# EAGLE schematic 14226 (EAGLE 7.6.0)
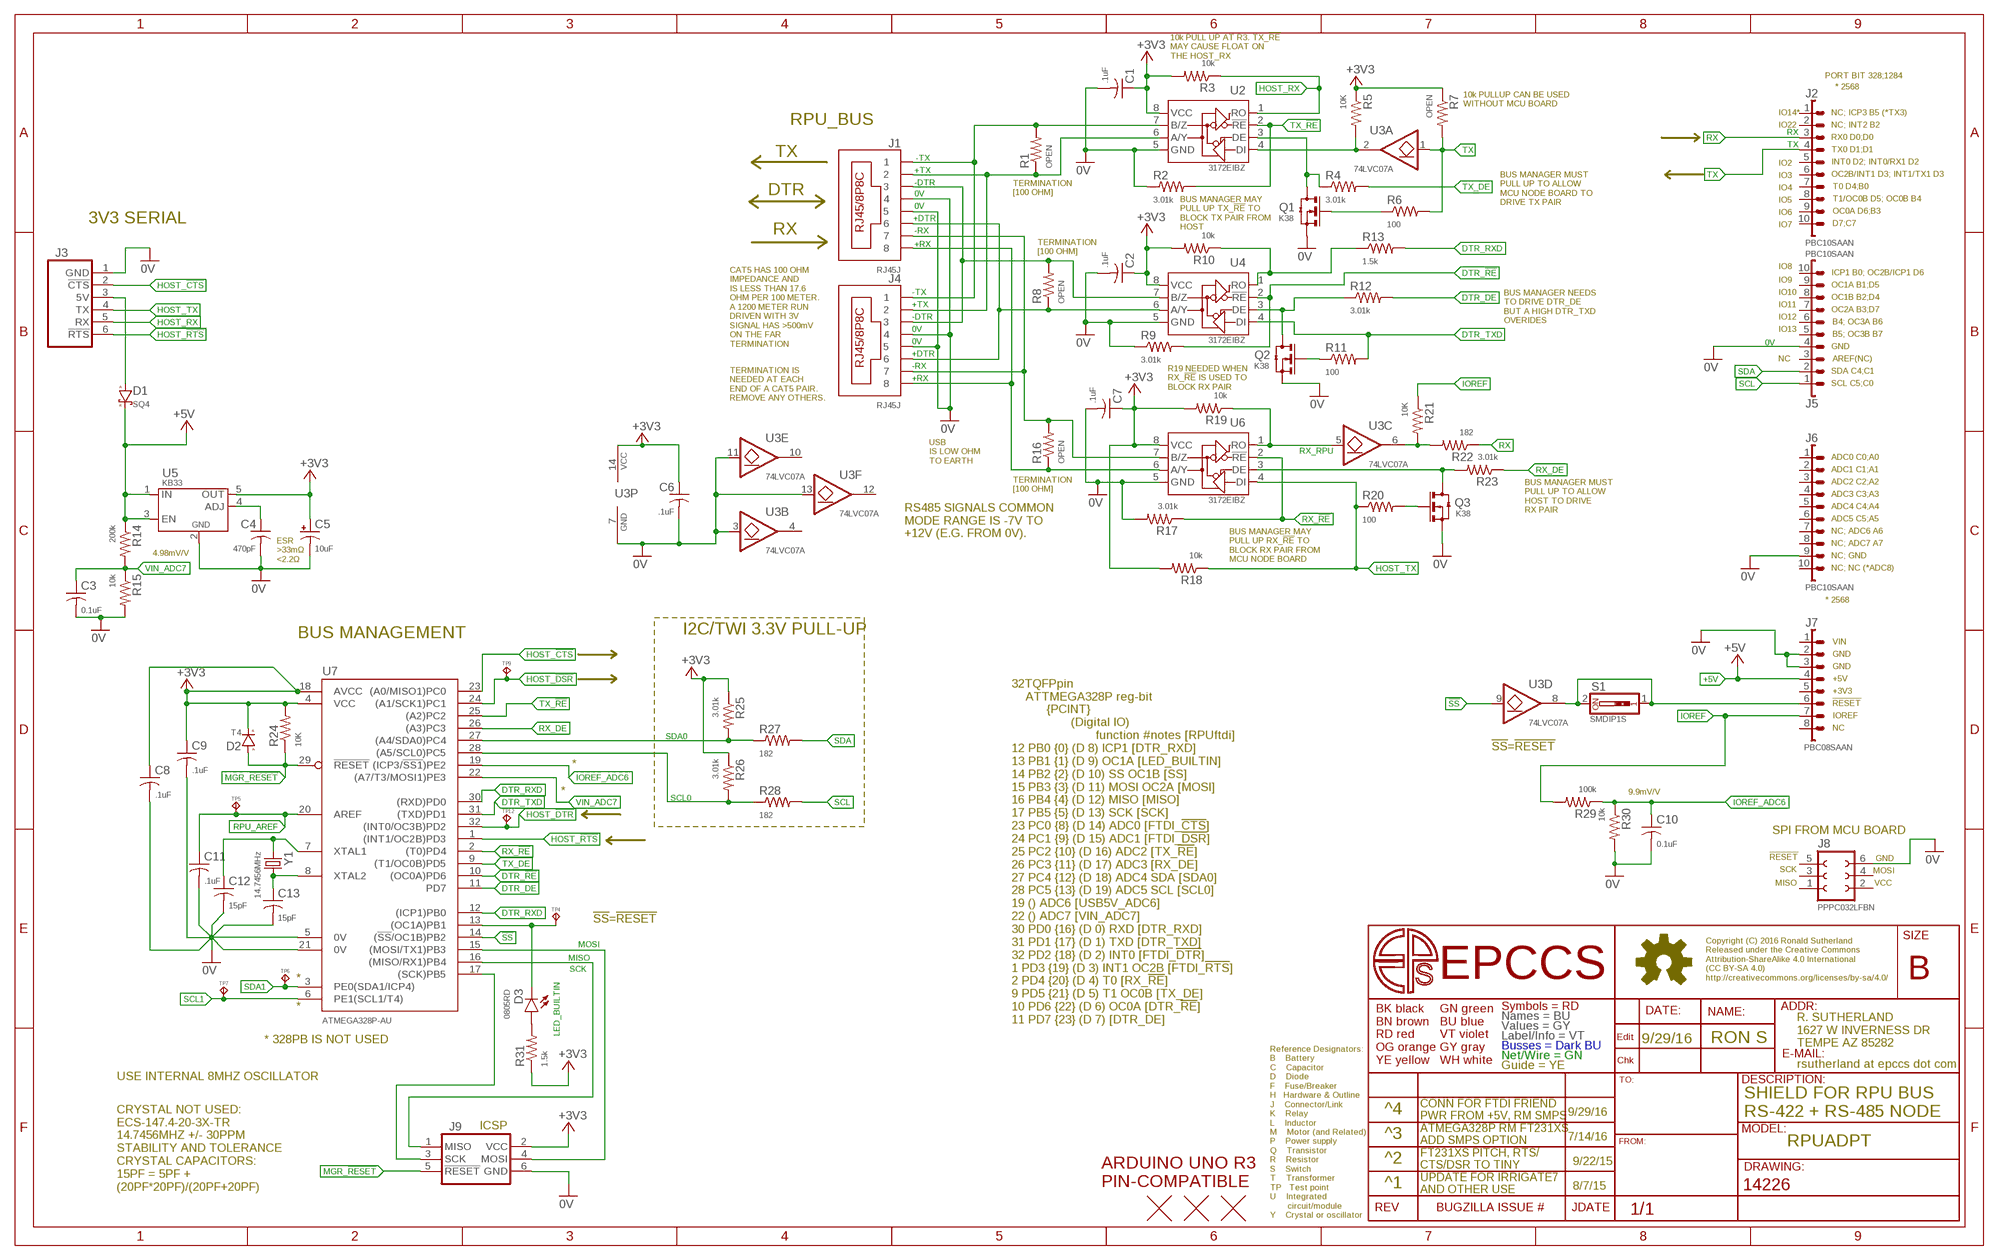
[diagram p0: schematic, sheet 1]

## Parts
C1  .1uF  CC0603A  [C0603(1608)]
C2  .1uF  CC0603A  [C0603(1608)]
C3  0.1uF  CC0603A  [C0603(1608)]
C4  470pF  CC0603A  [C0603(1608)]
C5  10uF  CT1206  [3216]
C6  .1uF  CC0603A  [C0603(1608)]
C7  .1uF  CC0603A  [C0603(1608)]
C8  .1uF  CC0603A  [C0603(1608)]
C9  .1uF  CC0603A  [C0603(1608)]
C10  0.1uF  CC0603A  [C0603(1608)]
C11  .1uF  CC0603A  [C0603(1608)]
C12  15pF  CC0603A  [C0603(1608)]
C13  15pF  CC0603A  [C0603(1608)]
D1  SQ4  DSMA  [SMA]
D2  T4  DSOD123  [SOD123]
D3  0805RD  LEDC0805(2012)  [C0805(2012)]
J1  RJ45J  RJ45-8HZT  [RJ45-8HZT]
J2  PBC10SAAN  1X10"  [1X10]
J3  FTDI-FRIEND  [FTDI-FRIEND]
J4  RJ45J  RJ45-8HZT  [RJ45-8HZT]
J5  PBC10SAAN  1X10"  [1X10]
J6  PBC10SAAN  1X10"  [1X10]
J7  PBC08SAAN  1X8"  [1X8]
J8  PPPC032LFBN  F2X3  [F2X3]
J9  ISP-SPIPTH  [ISP]
Q1  K38  N-CHSOT23  [SOT23]
Q2  K38  N-CHSOT23  [SOT23]
Q3  K38  N-CHSOT23  [SOT23]
R1  OPEN  R0805  [C0805(2012)]
R2  3.01k  R0805  [C0805(2012)]
R3  10k  R0805  [C0805(2012)]
R4  3.01k  R0805  [C0805(2012)]
R5  10K  R0805  [C0805(2012)]
R6  100  R0805  [C0805(2012)]
R7  OPEN  R0805  [C0805(2012)]
R8  OPEN  R0805  [C0805(2012)]
R9  3.01k  R0805  [C0805(2012)]
R10  10k  R0805  [C0805(2012)]
R11  100  R0805  [C0805(2012)]
R12  3.01k  R0805  [C0805(2012)]
R13  1.5k  R0805  [C0805(2012)]
R14  200k  R0805  [C0805(2012)]
R15  10k  R0805  [C0805(2012)]
R16  OPEN  R0805  [C0805(2012)]
R17  3.01k  R0805  [C0805(2012)]
R18  10k  R0805  [C0805(2012)]
R19  10k  R0805  [C0805(2012)]
R20  100  R0805  [C0805(2012)]
R21  10K  R0805  [C0805(2012)]
R22  182  R0805  [C0805(2012)]
R23  3.01k  R0805  [C0805(2012)]
R24  10K  R0805  [C0805(2012)]
R25  3.01k  R0805  [C0805(2012)]
R26  3.01k  R0805  [C0805(2012)]
R27  182  R0805  [C0805(2012)]
R28  182  R0805  [C0805(2012)]
R29  100k  R0805  [C0805(2012)]
R30  10k  R0805  [C0805(2012)]
R31  1.5k  R0805  [C0805(2012)]
S1  SMDIP1S  SW_DIP-1SMD  [SMD-DIPSWITCH-1]
TP4  TPPAD1-08  [P1-08]
TP5  TPPAD1-08  [P1-08]
TP6  TPPAD1-08  [P1-08]
TP7  TPPAD1-08  [P1-08]
TP9  TPPAD1-08  [P1-08]
TP12  TPPAD1-08  [P1-08]
U2  3172EIBZ  ISL3172EIBZ  [SOIC8]
U3  74LVC07A  7407D  [14SOIC]
U4  3172EIBZ  ISL3172EIBZ  [SOIC8]
U5  KB33  MIC5205  [SOT23-5,SOT25]
U6  3172EIBZ  ISL3172EIBZ  [SOIC8]
U7  ATMEGA328P-AU  ATMEGA328PB-AU  [TQFP32-08]
U$1  ARDUINO-UNO  [ARDUINO_UNO]
U$2  FIDUCIAL1.27  [FIDUCIAL-1.27]
U$3  FIDUCIAL1.27  [FIDUCIAL-1.27]
U$4  FIDUCIAL1.27  [FIDUCIAL-1.27]
Y1  14.7456MHz  CSM-3X  [CSM-3X]

## Nets
0V: C1.2 C2.2 C3.2 C4.2 C5.- C6.2 C7.2 C8.2 C9.2 C10.2 C11.2 C12.2 C13.2 J1.4 J1.5 J3.1(GND) J4.4 J4.5 J5.4 J6.9 J7.2 J7.3 J8.6 J9.6(GND) Q1.2(S)(S) Q2.2(S)(S) Q3.2(S)(S) R2.1 R9.1 R15.2 R17.2 R30.2 U2.5(GND) U3.3(B:I) U3.7(P:GND) U3.11(E:I) U3.13(F:I) U4.5(GND) U5.2(GND) U6.5(GND) U7.5(0V) U7.21(0V)
!SS!: U3.9(D:I) U7.14((!SS!/OC1B)PB2)
+3V3: C1.1 C2.1 C5.+ C6.1 C7.1 C8.1 C9.1 D2.C(K) J9.2(VCC) R3.2 R5.1 R7.1 R10.2 R18.2 R19.2 R24.2 R25.1 R26.1 R31.1 U2.8(VCC) U3.14(P:VCC) U4.8(VCC) U5.5(OUT) U6.8(VCC) U7.4(VCC) U7.18(AVCC)
+5V: D1.K J7.4 R14.1 U5.1(IN) U5.3(EN)
+DTR: J1.6 J4.6 R8.1 U4.6(A/Y)
+RX: J1.8 J4.8 R16.1 U6.6(A/Y)
+TX: J1.2 J4.2 R1.1 U2.6(A/Y)
-DTR: J1.3 J4.3 R8.2 U4.7(B/Z)
-RX: J1.7 J4.7 R16.2 U6.7(B/Z)
-TX: J1.1 J4.1 R1.2 U2.7(B/Z)
DTR_!RE: R9.2 U4.2(!RE) U7.10((OC0A)PD6)
DTR_DE: R12.2 U7.11(PD7)
DTR_RXD: R13.2 U7.12((ICP1)PB0) U7.30((RXD)PD0)
DTR_TXD: R11.2 U4.4(DI) U7.31((TXD)PD1)
HOST_!CTS: J3.2(!CTS) U7.23((A0/MISO1)PC0)
HOST_!DSR: TP9.TP U7.24((A1/SCK1)PC1)
HOST_!DTR: TP12.TP U7.32((INT0/OC3B)PD2)
HOST_!RTS: J3.6(!RTS) U7.1((INT1/OC2B)PD3)
HOST_RX: J3.5(RX) R3.1 U2.1(RO)
HOST_TX: J3.4(TX) R18.1 R20.1 U6.4(DI)
IOREF: J7.7 R21.1 R29.2
IOREF_ADC6: C10.1 R29.1 R30.1 U7.19((ICP3/!SS1!)PE2)
LED_BUILTIN: D3.K TP4.TP U7.13((OC1A)PB1)
MGR_!RESET: D2.A J9.5(!RESET) R24.1 U7.29(!RESET)
MISO: J9.1(MISO) U7.16((MISO/RX1)PB4)
MOSI: J9.4(MOSI) U7.15((MOSI/TX1)PB3)
N$1: D1.A J3.3(5V)
N$3: J7.6 S1.1 S1.2 U3.8(D:O)
N$10: R21.2 R22.2 U3.6(C:O)
N$11: Q3.3(D)(D) R23.2 U6.3(DE)
N$15: Q1.1(G)(G) R6.1
N$18: Q1.3(D)(D) R4.1 U2.3(DE)
N$19: R10.1 R13.1 U4.1(RO)
N$20: Q2.3(D)(D) R12.1 U4.3(DE)
N$22: Q2.1(G)(G) R11.1
N$24: C4.1 U5.4(ADJ)
N$25: Q3.1(G)(G) R20.2
N$29: D3.A R31.2
RPU_AREF: C11.1 TP5.TP U7.20(AREF)
RX: J2.3 R22.1
RX_!RE: R17.1 U6.2(!RE) U7.2((T0)PD4)
RX_DE: R23.1 U7.26((A3)PC3)
RX_RPU: R19.1 U3.5(C:I) U6.1(RO)
SCK: J9.3(SCK) U7.17((SCK)PB5)
SCL: J5.1 R28.2
SCL0: R26.2 R28.1 U7.28((A5/SCL0)PC5)
SCL1: TP7.TP U7.6(PE1(SCL1/T4))
SDA: J5.2 R27.2
SDA0: R25.2 R27.1 U7.27((A4/SDA0)PC4)
SDA1: TP6.TP U7.3(PE0(SDA1/ICP4))
TX: J2.4 R6.2 R7.2 U3.1(A:I)
TX_!RE: R2.2 U2.2(!RE) U7.25((A2)PC2)
TX_DE: R4.2 U7.9((T1/OC0B)PD5)
TX_RPU: R5.2 U2.4(DI) U3.2(A:O)
VIN_ADC7: C3.1 R14.2 R15.1 U7.22((A7/T3/MOSI1)PE3)
XTAL1: C12.1 U7.7(XTAL1) Y1.1
XTAL2: C13.1 U7.8(XTAL2) Y1.2
Unconnected: J2.1 J2.2 J2.5 J2.6 J2.7 J2.8 J2.9 J2.10 J5.3 J5.5 J5.6 J5.7 J5.8 J5.9 J5.10 J6.1 J6.2 J6.3 J6.4 J6.5 J6.6 J6.7 J6.8 J6.10 J7.1 J7.5 J7.8 J8.1 J8.2 J8.3 J8.4 J8.5 U3.4(B:O) U3.10(E:O) U3.12(F:O)

## Notes on the sheet
- 10k PULL UP AT R3. TX_!RE!
  MAY CAUSE FLOAT ON
  THE HOST_RX
- PORT BIT 328;1284
- * 2568
- 10k PULLUP CAN BE USED 
  WITHOUT MCU BOARD
- IO14* | NC; ICP3 B5 (*TX3)
- RPU_BUS | IO22 | NC; INT2 B2
- RX0 D0;D0
- TX0 D1;D1
- TX
- IO2 | INT0 D2; INT0/RX1 D2
- IO3 | OC2B/INT1 D3; INT1/TX1 D3
- IO4 | T0 D4;B0
- DTR
- TERMINATION
  [100 OHM]
- IO5 | T1/OC0B D5; OC0B B4
- BUS MANAGER MUST
  PULL UP TO ALLOW 
  MCU NODE BOARD TO 
  DRIVE TX PAIR
- IO6 | OC0A D6;B3
- 3V3 SERIAL | D7;C7
- IO7
- BUS MANAGER MAY
  PULL UP TX_!RE! TO
  BLOCK TX PAIR FROM
  HOST
- RX
- TERMINATION
  [100 OHM]
- IO8
- ICP1 B0; OC2B/ICP1 D6
- IO9
- OC1A B1;D5
- IO10
- OC1B B2;D4
- IO11
- OC2A B3;D7
- IO12
- BUS MANAGER NEEDS
  TO DRIVE DTR_DE
  BUT A HIGH DTR_TXD
  OVERIDES
- B4; OC3A B6
- IO13
- B5; OC3B B7
- CAT5 HAS 100 OHM 
  IMPEDANCE AND 
  IS LESS THAN 17.6 
  OHM PER 100 METER. 
  A 1200 METER RUN
  DRIVEN WITH 3V 
  SIGNAL HAS >500mV
  ON THE FAR
  TERMINATION
- GND
- NC | AREF(NC)
- SDA C4;C1
- SCL C5;C0
- R19 NEEDED WHEN
  RX_!RE! IS USED TO
  BLOCK RX PAIR
- TERMINATION IS 
  NEEDED AT EACH
  END OF A CAT5 PAIR.
  REMOVE ANY OTHERS.
- ADC0 C0;A0
- USB
  IS LOW OHM
  TO EARTH
- ADC1 C1;A1
- ADC2 C2;A2
- TERMINATION
  [100 OHM]
- ADC3 C3;A3
- ADC4 C4;A4
- BUS MANAGER MUST
  PULL UP TO ALLOW 
  HOST TO DRIVE
  RX PAIR
- ADC5 C5;A5
- NC; ADC6 A6
- RS485 SIGNALS COMMON 
  MODE RANGE IS -7V TO 
  +12V (E.G. FROM 0V).
- NC; ADC7 A7
- 4.98mV/V
- NC; GND
- ESR
  >33mΩ
  <2.2Ω
- BUS MANAGER MAY
  PULL UP RX_!RE! TO 
  BLOCK RX PAIR FROM 
  MCU NODE BOARD
- NC; NC (*ADC8)
- * 2568
- BUS MANAGEMENT | I2C/TWI 3.3V PULL-UP
- VIN
- GND
- GND
- +5V
- +3V3
- !RESET
- IOREF
- NC
- !SS!=!RESET!
- *
- * | 9.9mV/V
- SPI FROM MCU BOARD
- !RESET
- GND
- SCK
- MOSI
- MISO
- VCC
- !SS!=!RESET!
- *
- *
- 32TQFPpin
      ATTMEGA328P reg-bit
            {PCINT}
                   (Digital IO)
                          function #notes [RPUftdi]
  12 PB0 {0} (D 8) ICP1 [DTR_RXD]
  13 PB1 {1} (D 9) OC1A [LED_BUILTIN]
  14 PB2 {2} (D 10) SS OC1B [SS]
  15 PB3 {3} (D 11) MOSI OC2A [MOSI]
  16 PB4 {4} (D 12) MISO [MISO]
  17 PB5 {5} (D 13) SCK [SCK]
  23 PC0 {8} (D 14) ADC0 [FTDI_!CTS!]
  24 PC1 {9} (D 15) ADC1 [FTDI_!DSR!]
  25 PC2 {10} (D 16) ADC2 [TX_!RE!]
  26 PC3 {11} (D 17) ADC3 [RX_DE]
  27 PC4 {12} (D 18) ADC4 SDA [SDA0]
  28 PC5 {13} (D 19) ADC5 SCL [SCL0]
  19 () ADC6 [USB5V_ADC6]
  22 () ADC7 [VIN_ADC7]
  30 PD0 {16} (D 0) RXD [DTR_RXD]
  31 PD1 {17} (D 1) TXD [DTR_TXD]
  32 PD2 {18} (D 2) INT0 [FTDI_!DTR!]
  1 PD3 {19} (D 3) INT1 OC2B [FTDI_!RTS!]
  2 PD4 {20} (D 4) T0 [RX_!RE!]
  9 PD5 {21} (D 5) T1 OC0B [TX_DE]
  10 PD6 {22} (D 6) OC0A [DTR_!RE!]
  11 PD7 {23} (D 7) [DTR_DE]
- * 328PB IS NOT USED | 9/29/16 | RON S
- USE INTERNAL 8MHZ OSCILLATOR
- ^4 | 9/29/16
- SHIELD FOR RPU BUS
  RS-422 + RS-485 NODE
- CONN FOR FTDI FRIEND
  PWR FROM +5V, RM SMPS
- ICSP
- ^3 | 7/14/16
- ATMEGA328P RM FT231XS
  ADD SMPS OPTION
- RPUADPT
- ^2 | 9/22/15
- FT231XS PITCH, RTS/
  CTS/DSR TO TINY
- ^1 | 8/7/15
- CRYSTAL NOT USED:
  ECS-147.4-20-3X-TR
  14.7456MHZ +/- 30PPM
  STABILITY AND TOLERANCE
  CRYSTAL CAPACITORS:
  15PF = 5PF +
  (20PF*20PF)/(20PF+20PF)
- UPDATE FOR IRRIGATE7
  AND OTHER USE

## Library data of the parts
C1-C4 C6-C13 = C-C:C: CAPACITOR Symbol
C5 = C-T:CT: Tantalum Electrolytic Capacitor
D1 = D-SBR:D: DIODE
D2 = D-GP:D: DIODE
D3 = D-LED:LED: LED 120120WH [CREE,XHGAWT-00-0000-00000HXE1] LED WHITE 6500K 150LUM-W120120
J1 J4 = J-RJ45:RJ45-8: RJ45 Jack RJ45J [ASSMANN,A-2014-2-4-R] JACK MODULAR VERT PCB 8P8C UNSHIELD Horz version form sparkfun sku PRT-00643, and breakout board sku is BOB-00716.
J2 J5 J6 = J-HDR2.54mm:1X10: 10 POS HEADER PBC10S [SULLINS,PBC10SAAN]HEADER MALE BRKWAY 10POS .1IN AA
J3 = U-AVR:FTDI-FRIEND: used for serial interfaces and serial bootloaders optiboot does not read the fuse but reports as they should be. It also erases chip. avrdude -c arduino -v -p atmega328p -P /dev/ttyUSB0 -b 115200 -U flash:w:BlinkLED.hex xboot use -e to erase chip, and -u to disable fuse checks since bootloaders can't see them. avrdude -c avr109 -v -p atmega1284p -P /dev/ttyUSB0 -b 115200 -e -u -U flash:w:BlinkLED.hex Arduino uses the nRTS (or nDTR) negative going edge to start the bootloader by causing a reset on the MCU.
J7 = J-HDR2.54mm:1X8: 8 POS HEADER PBC08SAAN [SULLINS,PBC08SAAN]HEADER MALE BRKWAY 8POS .1IN AA
J8 = J-HDR2.54mm:F2X3: FEMALE HEADER 2X3POS
J9 = U-AVR:ISP-SPI: AVR ISP thru SPI In-System Programming uses the target Atmel AVR’s internal SPI (Serial Peripheral Interface) to download code into the flash and EEPROM memories. It is not a debugging interface. When designing an application PCB which includes an AVR with the SPI interface, this pinout should be used. Sparkfun SKU: BOB-08508
Q1-Q3 = Q-NCH:N-CH?*: ENHANCEMENT MODE MOSFET SOT23 is BSS138 pinout
R1-R31 = R-C:R: Resiistor American-style symbol
S1 = S-Toggle:SW_DIP-1
TP4-TP7 TP9 TP12 = J-TP:TP: Test pad
U2 U4 U6 = U-Transceiver:ISL3172E: TRANSCEIVER RS485 3.3V HALFDPLX
U3 = U-7400:74*07: HEX BUFFER, OPEN DRAIN/COLLECTOR 74LVC07A [DIODES,74LVC07AS14-13] LOGIC BUFFER OPEN DRAIN 14SOIC
U5 = P-DCDC:MIC5205: KB33 [MICREL,MIC5205-3.3YM5] REG ULDO 3V3 150MA SOT23-5
U7 = U-AVR:ATMEGA328PB-AU: ATmega328PB 4 Kbytes FLASH 128 bytes SRAM 256 bytes EEPROM 2 UART, 2 I2C, 2 SPI 8-channel 10 bit ADC
U$1 = J-BoardHDR:ARDUINO-UNO: Board Outline with holes and silk note the board dim layer is not defined
U$2-U$4 = H-Fiducial:FIDUCIAL: Fiducial Alignment Points Various fiducial points for machine vision alignment.
Y1 = Y-XTL:CSM: 16MHZ20 [ECS,ECS-160-20-3X-TR] CRYSTAL 16MHZ 20PF 30PPM CSM-3X

## Net classes
0 default: width 0.254 mm, drill 0.33 mm